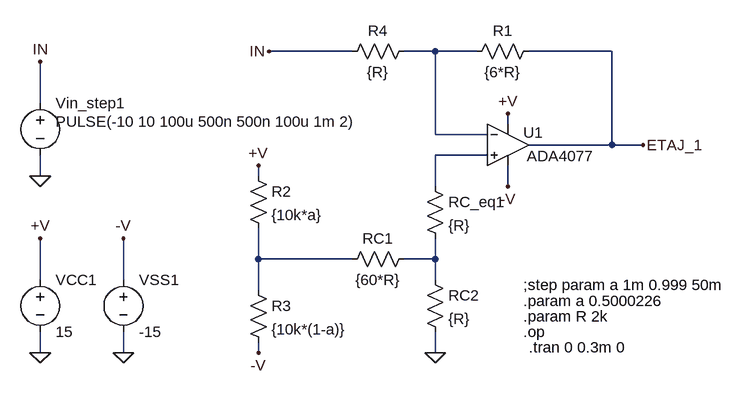
[diagram p0: schematic SR.asc]
SR.asc, the LTspice schematic file:
Version 4
SHEET 1 1048 724
WIRE -80 -80 -208 -80
WIRE 48 -80 0 -80
WIRE 112 -80 48 -80
WIRE 320 -80 192 -80
WIRE -560 0 -560 -64
WIRE 160 32 160 16
WIRE 48 48 48 -80
WIRE 128 48 48 48
WIRE 320 64 320 -80
WIRE 320 64 192 64
WIRE 368 64 320 64
WIRE 128 80 48 80
WIRE -560 112 -560 80
WIRE -224 112 -224 96
WIRE 48 128 48 80
WIRE 160 128 160 96
WIRE -224 240 -224 192
WIRE -80 240 -224 240
WIRE 48 240 48 208
WIRE 48 240 0 240
WIRE -560 272 -560 208
WIRE -432 272 -432 208
WIRE 48 272 48 240
WIRE -224 288 -224 240
WIRE -560 384 -560 352
WIRE -432 384 -432 352
WIRE -224 384 -224 368
WIRE 48 384 48 352
FLAG -224 96 +V
FLAG -224 384 -V
FLAG -208 -80 IN
FLAG 160 128 -V
FLAG 160 16 +V
FLAG 48 384 0
FLAG 368 64 ETAJ_1
FLAG -560 -64 IN
FLAG -560 384 0
FLAG -432 384 0
FLAG -560 208 +V
FLAG -432 208 -V
FLAG -560 112 0
DATAFLAG -144 -80 ""
SYMBOL res 208 -96 R90
WINDOW 0 0 56 VBottom 2
WINDOW 3 32 56 VTop 2
SYMATTR InstName R1
SYMATTR Value {6*R}
SYMBOL res -96 256 R270
WINDOW 0 32 56 VTop 2
WINDOW 3 0 56 VBottom 2
SYMATTR InstName RC1
SYMATTR Value {60*R}
SYMBOL res -240 96 R0
SYMATTR InstName R2
SYMATTR Value {10k*a}
SYMBOL res -240 272 R0
SYMATTR InstName R3
SYMATTR Value {10k*(1-a)}
SYMBOL res 16 -96 R90
WINDOW 0 0 56 VBottom 2
WINDOW 3 32 56 VTop 2
SYMATTR InstName R4
SYMATTR Value {R}
SYMBOL res 32 112 R0
SYMATTR InstName RC_eq1
SYMATTR Value {R}
SYMBOL res 32 256 R0
SYMATTR InstName RC2
SYMATTR Value {R}
SYMBOL OpAmps\\ADA4077 160 0 R0
WINDOW 0 24 45 Left 2
WINDOW 3 29 81 Left 2
SYMATTR InstName U1
SYMBOL voltage -560 256 R0
WINDOW 123 0 0 Left 2
WINDOW 39 0 0 Left 2
SYMATTR InstName VCC1
SYMATTR Value 15
SYMBOL voltage -432 256 R0
WINDOW 123 0 0 Left 2
WINDOW 39 0 0 Left 2
SYMATTR InstName VSS1
SYMATTR Value -15
SYMBOL voltage -560 -16 R0
WINDOW 3 24 44 Left 2
WINDOW 123 24 72 Left 2
WINDOW 39 0 0 Left 2
SYMATTR Value PULSE(-10 10 100u 500n 500n 100u 1m 2)
SYMATTR InstName Vin_step1
TEXT 184 304 Left 2 !.param a 0.5000226
TEXT 192 376 Left 2 !.tran 0 0.3m 0
TEXT 184 328 Left 2 !.param R 2k
TEXT 184 352 Left 2 !.op
TEXT 184 280 Left 2 !;step param a 1m 0.999 50m

The netlist it stands for:
* SR.asc
R1 ETAJ_1 N001 {6*R}
RC1 N003 N004 {60*R}
R2 +V N003 {10k*a}
R3 N003 -V {10k*(1-a)}
R4 N001 IN {R}
RC_eq1 N002 N004 {R}
RC2 N004 0 {R}
XU1 N002 N001 +V -V ETAJ_1 ADA4077  ; pins In+ In- V+ V- OUT
VCC1 +V 0 15
VSS1 -V 0 -15
Vin_step1 IN 0 PULSE(-10 10 100u 500n 500n 100u 1m 2)
.param a 0.5000226
.tran 0 0.3m 0
.param R 2k
.op
;step param a 1m 0.999 50m
.backanno
.end